# Altium schematic sheet 04_Function_260316_V02.SchDoc
size A3
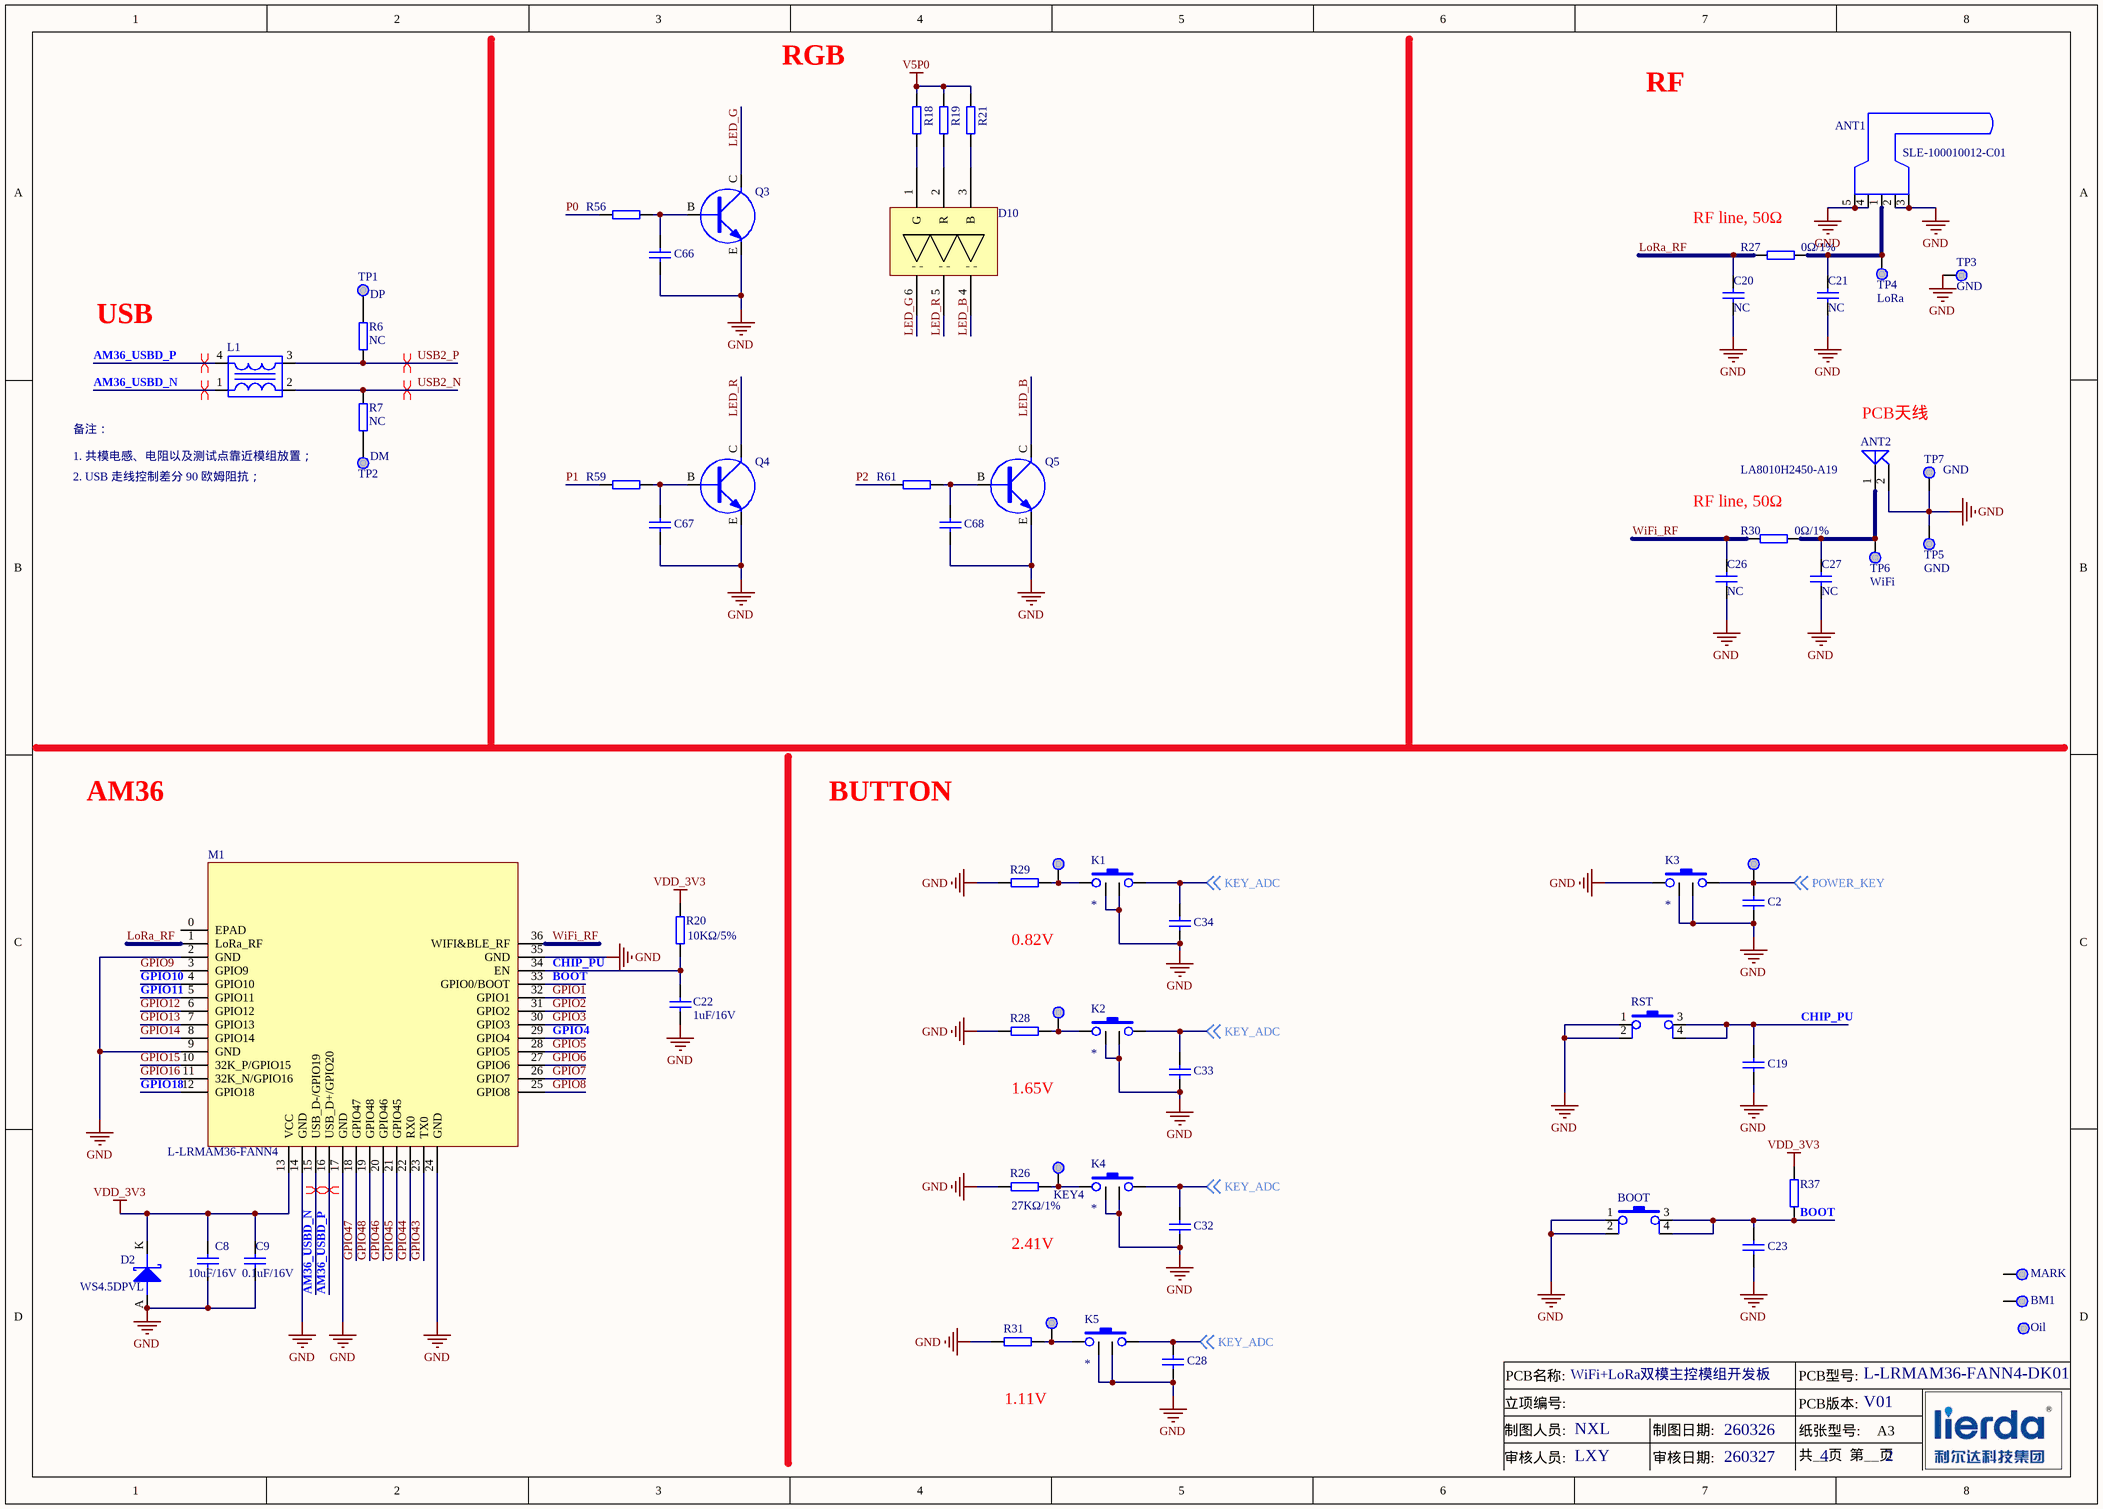
[diagram p0: 04_Function_260316_V02.SchDoc]

## Parts
ANT1  产品型号: SLE-100010012-C01  [SMA-SMD]  (hidden comment: ANT P5)
ANT2  产品型号: LA8010H2450-A19  [2.4G_5.5X12]  (hidden comment: ANT 2P)
BM1  BadMARK  [Bad Mark]  (value not drawn)
BOOT  BUTTON-4  [SW-4.2X3.2-4P-S]  (value not drawn)
C2  NC  [0402C_0.4D]  (value not drawn)
C8  10uF/16V  [0402C_0.4D]
C9  0.1uF/16V  [0402C_0.4D]
C19  100pF  [0402C_0.4D]  (value not drawn)
C20  NC  [0402C_0.4D]
C21  NC  [0402C_0.4D]
C22  1uF/16V  [0402C_0.4D]
C23  100pF  [0402C_0.4D]  (value not drawn)
C26  NC  [0402C_0.4D]
C27  NC  [0402C_0.4D]
C28  100pF  [0402C_0.4D]  (value not drawn)
C32  100pF  [0402C_0.4D]  (value not drawn)
C33  100pF  [0402C_0.4D]  (value not drawn)
C34  100pF  [0402C_0.4D]  (value not drawn)
C66  100pF  [0402C_0.4D]  (value not drawn)
C67  100pF  [0402C_0.4D]  (value not drawn)
C68  100pF  [0402C_0.4D]  (value not drawn)
D2  产品型号: WS4.5DPVL  [UDFN2(1610)]  (hidden comment: DIODE-TVS)
D10  MHP5050DRGBCT  [D5050-RGB]  (value not drawn)
K1  BUTTON-2-2  [1188E-1W3-V-T/R]  (value not drawn)
K2  BUTTON-2-2  [1188E-1W3-V-T/R]  (value not drawn)
K3  BUTTON-2-2  [1188E-1W3-V-T/R]  (value not drawn)
K4  BUTTON-2-2  [1188E-1W3-V-T/R]  (value not drawn)
K5  BUTTON-2-2  [1188E-1W3-V-T/R]  (value not drawn)
KEY3  MARK  [TEST]  (value not drawn)
KEY4  MARK  [TEST]  (value not drawn)
KEY5  MARK  [TEST]  (value not drawn)
KEY6  MARK  [TEST]  (value not drawn)
KEY7  MARK  [TEST]  (value not drawn)
L1  DLM0NSN900HY2D  [L-0.85X0.65]  (value not drawn)
M1  L-LRMAM36-FANN4  [L-LRMAM36-FANN4]
MK1  MARK  [MARK]
Oil1  Oil  [White oil-9X9]
Q3  NPN  [SOT-723-3A]  (value not drawn)
Q4  NPN  [SOT-723-3A]  (value not drawn)
Q5  NPN  [SOT-723-3A]  (value not drawn)
R6  产品型号: NC  [0201_0.25D]  (hidden comment: RES-NBOM)
R7  产品型号: NC  [0201_0.25D]  (hidden comment: RES-NBOM)
R18  620R  [0402R_0.4D]  (value not drawn)
R19  620R  [0402R_0.4D]  (value not drawn)
R20  10KΩ/5%  [0402R_0.4D]
R21  620R  [0402R_0.4D]  (value not drawn)
R26  27KΩ/1%  [0402R_0.4D]
R27  0Ω/1%  [0402R_0.4D]
R28  10KΩ/1%  [0402R_0.4D]  (value not drawn)
R29  3.3KΩ/1%  [0402R_0.4D]  (value not drawn)
R30  0Ω/1%  [0402R_0.4D]
R31  5.1KΩ/1%  [0402R_0.4D]  (value not drawn)
R37  10KΩ/1%  [0402R_0.4D]  (value not drawn)
R56  0Ω/1%  [0402R_0.4D]  (value not drawn)
R59  0Ω/1%  [0402R_0.4D]  (value not drawn)
R61  0Ω/1%  [0402R_0.4D]  (value not drawn)
RST  BUTTON-4  [SW-4.2X3.2-4P-S]  (value not drawn)
TP1  DP  [TEST]
TP2  DM  [TEST]
TP3  GND  [TEST]
TP4  LoRa  [TEST]
TP5  GND  [TEST]
TP6  WiFi  [TEST]
TP7  GND  [TEST]

## Nets
GND: ANT1.2 ANT1.3 ANT1.4 ANT1.5 ANT2.2 BOOT.1 BOOT.2 C2.1 C8.1 C9.1 C19.1 C20.1 C21.1 C22.1 C23.1 C26.1 C27.1 C28.1 C32.1 C33.1 C34.1 C66.1 C67.1 C68.1 D2.A K1.0 K2.0 K3.0 K3.1 K4.0 K5.0 M1.2(GND) M1.9(GND) M1.14(GND) M1.17(GND) M1.24(GND) M1.35(GND) Q3.E Q4.E Q5.E R26.1 R28.2 R29.1 R31.1 RST.1 RST.2 TP3.1 TP5.1 TP7.1
V5P0: R18.2 R19.2 R21.2
VDD_3V3: C8.2 C9.2 D2.K M1.13(VCC) R20.2 R37.1
AM36_USBD_N: L1.1 M1.15(USB_D-/GPIO19)
AM36_USBD_P: L1.4 M1.16(USB_D+/GPIO20)
BOOT: BOOT.3 BOOT.4 C23.2 M1.33(GPIO0/BOOT) R37.2
CHIP_PU: C19.2 C22.2 M1.34(EN) R20.1 RST.3 RST.4
GPIO1: M1.32(GPIO1)
GPIO2: M1.31(GPIO2)
GPIO3: M1.30(GPIO3)
GPIO4: M1.29(GPIO4)
GPIO5: M1.28(GPIO5)
GPIO6: M1.27(GPIO6)
GPIO7: M1.26(GPIO7)
GPIO8: M1.25(GPIO8)
GPIO9: M1.3(GPIO9)
GPIO10: M1.4(GPIO10)
GPIO11: M1.5(GPIO11)
GPIO12: M1.6(GPIO12)
GPIO13: M1.7(GPIO13)
GPIO14: M1.8(GPIO14)
GPIO15: M1.10(32K_P/GPIO15)
GPIO16: M1.11(32K_N/GPIO16)
GPIO18: M1.12(GPIO18)
GPIO43: M1.23(TX0)
GPIO44: M1.22(RX0)
GPIO45: M1.21(GPIO45)
GPIO46: M1.20(GPIO46)
GPIO47: M1.18(GPIO47)
GPIO48: M1.19(GPIO48)
KEY_ADC: C28.2 C32.2 C33.2 C34.2 K1.2 K2.2 K4.2 K5.2 ; off-sheet KEY_ADC
LED_B: D10.4(|) Q5.C
LED_G: D10.6(|) Q3.C
LED_R: D10.5(|) Q4.C
LoRa_RF: C20.2 M1.1(LoRa_RF) R27.1
P0: R56.1
P1: R59.1
P2: R61.1
POWER_KEY: C2.2 K3.2 KEY7.1 ; off-sheet POWER_KEY
USB2_N: L1.2 R7.2
USB2_P: L1.3 R6.1
WiFi_RF: C26.2 M1.36(WIFI&BLE_RF) R30.1
NetANT1_1: ANT1.1 C21.2 R27.2 TP4.1
NetANT2_1: ANT2.1 C27.2 R30.2 TP6.1
NetC66_2: C66.2 Q3.B R56.2
NetC67_2: C67.2 Q4.B R59.2
NetC68_2: C68.2 Q5.B R61.2
NetD10_1: D10.1(G) R18.1
NetD10_2: D10.2(R) R19.1
NetD10_3: D10.3(B) R21.1
NetK1_1: K1.1 KEY6.1 R29.2
NetK2_1: K2.1 KEY5.1 R28.1
NetK4_1: K4.1 KEY4.1 R26.2
NetK5_1: K5.1 KEY3.1 R31.2
NetR6_2: R6.2 TP1.1
NetR7_1: R7.1 TP2.1

Not connected (* = marked no-connect by the designer): BM1 1; M1 0(EPAD); MK1 1

## Layout directives
differential pair: AM36_USBD_N, AM36_USBD_P, USB2_N, USB2_P

## Notes on the sheet
- RGB
- RF
- (near R27) RF line, 50Ω
- USB
- 备注：
- PCB天线
- 1. 共模电感、电阻以及测试点靠近模组放置；
- 2. USB 走线控制差分 90 欧姆阻抗；
- (near R30) RF line, 50Ω
- AM36
- BUTTON
- 0.82V
- 1.65V
- 2.41V
- PCB名称:
- WiFi+LoRa双模主控模组开发板
- PCB型号:
- (near Oil1) L-LRMAM36-FANN4-DK01
- 1.11V
- 制图人员:
- 审核人员:
- 立项编号:
- NXL
- LXY
- 制图日期:
- 审核日期:
- 260326
- 260327
- 纸张型号:
- 共__页  第__页
- PCB版本:
- 4
- V01
- A3
- 2

## Library data of the parts
ANT1 = 1416000904: 180°/SMA; 品名: 射频接头; 原厂品牌: 森岭; 封装: 其他; 物料状态: 优选; 存货编码: 1416000904
ANT2 = 1410029035: 2875MHz/2450MHz; 品名: 陶瓷天线; 原厂品牌: 嘉兴佳利; 封装: SMD; 物料状态: 限用; 存货编码: 1410029035
BOOT RST = 1414000735: 4.2*3.2*2.5mm; 产品型号: TS3443-0253B; 品名: 轻触开关; 原厂品牌: 苏州菀钛; 封装: SMD; 物料状态: 客定; 存货编码: 1414000735
C2 C19 C23 C28 C32-C34 C66-C68 = 1405000464: 0.1uF/16V/10%/X7R; 产品型号: CL05B104KO5NNNC; 品名: 陶瓷电容; 原厂品牌: SAMSUNG电容; 封装: 0402; 存货编码: 1405000464
C8 = 1405000464: 0.1uF/16V/10%/X7R; 产品型号: CL05B104KO5NNNC; 器件名称: 陶瓷电容; 原厂品牌: SAMSUNG电容; 封装: 0402; Value: 0.1uF; 存货编码: 1405000464
C9 = 1405002139: 10nF/50V/5%/X7R; 产品型号: CC0402JRX7R9BB103; 器件名称: 陶瓷电容; 原厂品牌: YAGEO; 封装: 0402; 存货编码: 1405002139
C20 C21 C26 C27 = 1405000291: 33pF/50V/5%/C0G; 产品型号: CC0402JRNPO9BN330; 品名: 陶瓷电容; 原厂品牌: YAGEO; 封装: 0402; 物料状态: 优选; 存货编码: 1405000291
C22 = 1405004038: 1uF/16V/10%/X5R; 产品型号: CL05A105KO5NNNC; 品名: 陶瓷电容; 原厂品牌: SAMSUNG电容; 封装: 0402; 存货编码: 1405004038
D2 = 1409003028: 单向/4.5V/2160W; 品名: TVS管; 原厂品牌: WAYON（维安）; 封装: DFN1610-2L; 存货编码: 1409003028
K1-K5 = 1414000145: 7.8*3.5*3.5mm; 产品型号: *; 存货编码: 1414000145
L1 = 1404002237: 90Ω/0.1A/3.8Ω; 产品型号: DLM0NSM900HY2#; 品名: 扼流圈（共模）; 原厂品牌: MURATA; 封装: SMD; 项目类型: OEM; 存货编码: 1404002237
Q3-Q5 = 1412002731: NPN/100mA/50V/100mW; 产品型号: DTC143ZM; 品名: 三极管; 原厂品牌: CJ; 封装: SOT-723; 物料状态: 优选; 存货编码: 1412002731
R18 R19 R21 = 1408006136: 620R/5%; 产品型号: 0402WGJ0621TCE; 品名: 厚膜贴片电阻; 原厂品牌: Uniohm; 封装: 0402; 物料状态: 限用; 存货编码: 1408006136
R20 = 1408000526: 产品型号: 0402WGJ0103TCE; 品名: 厚膜贴片电阻; 原厂品牌: Uniohm; 封装: 0402; 物料状态: 优选; 存货编码: 1408000526
R26 = 1408000585: 产品型号: 0402WGF2702TCE; 品名: 厚膜贴片电阻; 原厂品牌: Uniohm; 封装: 0402; 物料状态: 优选; 存货编码: 1408000585
R27 R30 R56 R59 R61 = 1408000124: 产品型号: 0402WGF0000TCE; 品名: 厚膜贴片电阻; 原厂品牌: Uniohm; 封装: 0402; 物料状态: 优选; 存货编码: 1408000124
R28 R37 = 1408000127: 产品型号: 0402WGF1002TCE; 品名: 厚膜贴片电阻; 原厂品牌: Uniohm; 封装: 0402; 物料状态: 优选; 存货编码: 1408000127
R29 = 1408001016: 产品型号: 0402WGF3301TCE; 品名: 厚膜贴片电阻; 原厂品牌: Uniohm; 封装: 0402; 物料状态: 优选; 存货编码: 1408001016
R31 = 1408001245: 产品型号: RC0402FR-075K1L; 品名: 厚膜贴片电阻; 原厂品牌: YAGEO; 封装: 0402; 物料状态: 优选; 存货编码: 1408001245
TP1-TP7 = MARK: 产品型号: MARK
KEY3-KEY7 MK1 = MARK
  MK1: 产品型号: MARK
Oil1 = Oil: 产品型号: Oil